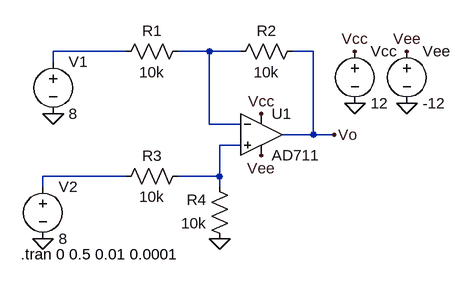
[diagram p0: schematic Week4 Prelab1.asc]
Week4 Prelab1.asc, the LTspice schematic file:
Version 4
SHEET 1 880 680
WIRE 48 32 -64 32
WIRE 176 32 128 32
WIRE 224 32 176 32
WIRE 336 32 304 32
WIRE -64 48 -64 32
WIRE 176 144 176 32
WIRE 224 144 176 144
WIRE 336 160 336 32
WIRE 336 160 288 160
WIRE 368 160 336 160
WIRE 224 176 192 176
WIRE 48 224 -80 224
WIRE 192 224 192 176
WIRE 192 224 128 224
WIRE -80 240 -80 224
WIRE 192 240 192 224
FLAG -80 320 0
FLAG -64 128 0
FLAG 400 112 0
FLAG 480 112 0
FLAG 192 320 0
FLAG 400 32 Vcc
FLAG 256 128 Vcc
FLAG 256 192 Vee
FLAG 480 32 Vee
FLAG 368 160 Vo
SYMBOL OpAmps\\AD711 256 96 R0
SYMATTR InstName U1
SYMBOL voltage 400 16 R0
SYMATTR InstName Vcc
SYMATTR Value 12
SYMBOL voltage 480 16 R0
SYMATTR InstName Vee
SYMATTR Value -12
SYMBOL voltage -64 32 R0
SYMATTR InstName V1
SYMATTR Value 8
SYMBOL voltage -80 224 R0
SYMATTR InstName V2
SYMATTR Value 8
SYMBOL res 320 16 R90
WINDOW 0 0 56 VBottom 2
WINDOW 3 32 56 VTop 2
SYMATTR InstName R2
SYMATTR Value 10k
SYMBOL res 144 208 R90
WINDOW 0 0 56 VBottom 2
WINDOW 3 32 56 VTop 2
SYMATTR InstName R3
SYMATTR Value 10k
SYMBOL res 144 16 R90
WINDOW 0 0 56 VBottom 2
WINDOW 3 32 56 VTop 2
SYMATTR InstName R1
SYMATTR Value 10k
SYMBOL res 208 336 R180
WINDOW 0 36 76 Left 2
WINDOW 3 36 40 Left 2
SYMATTR InstName R4
SYMATTR Value 10k
TEXT -114 344 Left 2 !.tran 0 0.5 0.01 0.0001

The netlist it stands for:
* Week4 Prelab1.asc
XU1 N003 N002 Vcc Vee Vo AD712  ; AD711, pins In+ In- V+ V- OUT
Vcc Vcc 0 12
Vee Vee 0 -12
V1 N001 0 8
V2 N004 0 8
R2 Vo N002 10k
R3 N003 N004 10k
R1 N002 N001 10k
R4 0 N003 10k
.tran 0 0.5 0.01 0.0001
.lib ADI1.lib
.backanno
.end